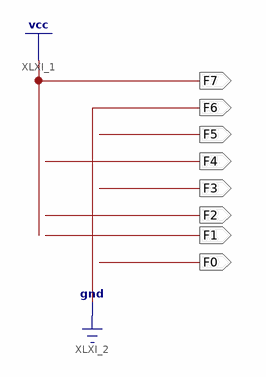
[diagram p0: schematic sheet 1]
// Xilinx ISE schematic C3_24.sch (kintex7) as structural Verilog: 0 symbols, 8 ports
module C3_24 (
  output F7,
  output F6,
  output F5,
  output F4,
  output F3,
  output F2,
  output F1,
  output F0
);


  assign F6 = 1'b0;
  assign F7 = 1'b1;
endmodule
